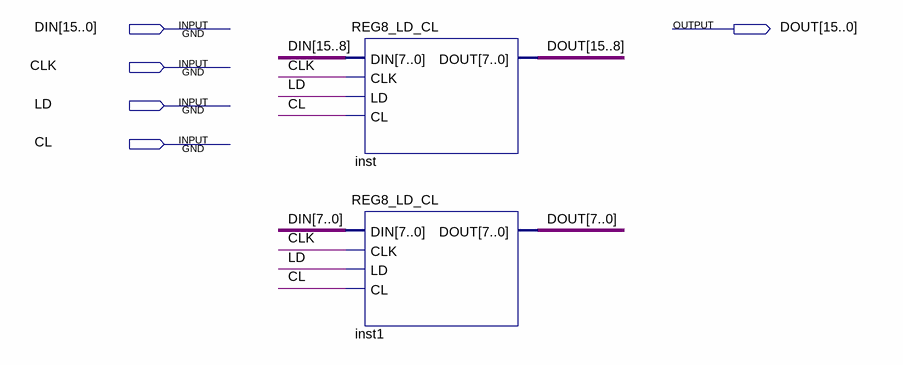
[diagram p0: schematic sheet]
// Quartus schematic REG16_LD_CL.bdf as structural Verilog: 2 symbols, 5 pins
module REG16_LD_CL (
  input  [15:0] DIN,
  input  CLK,
  input  LD,
  input  CL,
  output [15:0] DOUT
);

  REG8_LD_CL inst (.DIN(DIN[15:8]), .CLK(CLK), .LD(LD), .CL(CL), .DOUT(DOUT[15:8]));
  REG8_LD_CL inst1 (.DIN(DIN[7:0]), .CLK(CLK), .LD(LD), .CL(CL), .DOUT(DOUT[7:0]));
endmodule
